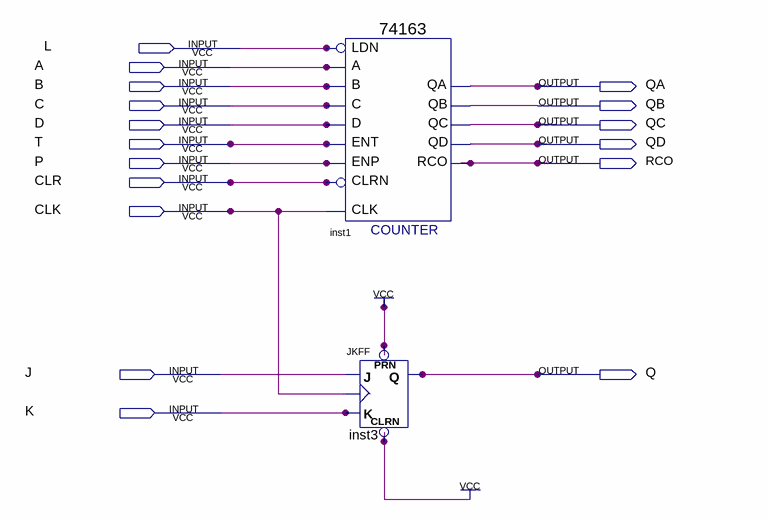
[diagram p0: schematic sheet]
// Quartus schematic lab3uppgift1.bdf as structural Verilog: 2 symbols, 17 pins
module lab3uppgift1 (
  input  L,
  input  A,
  input  B,
  input  C,
  input  D,
  input  T,
  input  P,
  input  CLR,
  input  CLK,
  input  J,
  input  K,
  output QA,
  output QB,
  output QC,
  output QD,
  output RCO,
  output Q
);

  \74163  inst1 (
    .C(C), .B(B), .A(A), .ENT(T), .D(D), .CLRN(CLR), .CLK(CLK), .ENP(P), .LDN(L), .QA(QA), .QB(QB), .QC(QC),
    .QD(QD), .RCO(RCO));
  JKFF inst3 (.PRN(1'b1), .CLRN(1'b1), .K(K), .J(J), .CLK(CLK), .Q(Q));
endmodule
